# Altium schematic sheet Control.SchDoc
size A4; SheetNumber: 2; SheetTotal: 4
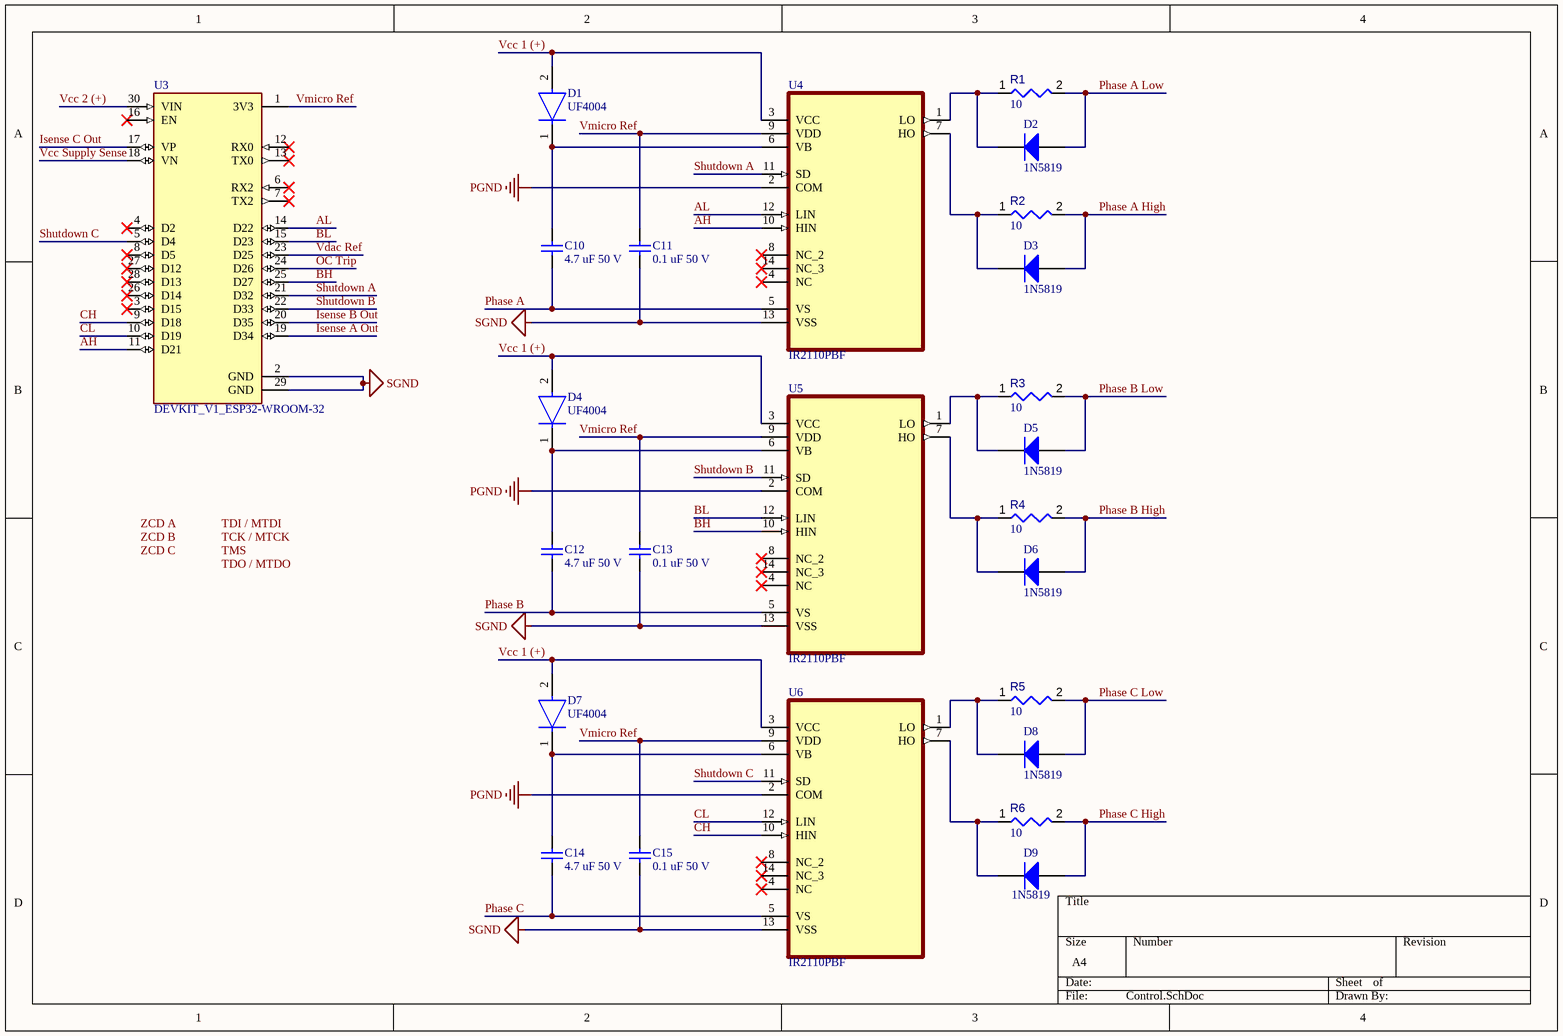
[diagram p0: Control.SchDoc]

## Parts
C10  4.7 uF 50 V  [CAPR51-254-508X318X736]
C11  0.1 uF 50 V  [CAPR51-254-508X318X736]
C12  4.7 uF 50 V  [CAPR51-254-508X318X736]
C13  0.1 uF 50 V  [CAPR51-254-508X318X736]
C14  4.7 uF 50 V  [CAPR51-254-508X318X736]
C15  0.1 uF 50 V  [CAPR51-254-508X318X736]
D1  UF4004  [FP-017AH-MFG]
D2  1N5819  [ONSC-AXIAL_LEAD-2-59-10_P]
D3  1N5819  [ONSC-AXIAL_LEAD-2-59-10_P]
D4  UF4004  [FP-017AH-MFG]
D5  1N5819  [ONSC-AXIAL_LEAD-2-59-10_P]
D6  1N5819  [ONSC-AXIAL_LEAD-2-59-10_P]
D7  UF4004  [FP-017AH-MFG]
D8  1N5819  [ONSC-AXIAL_LEAD-2-59-10_P]
D9  1N5819  [ONSC-AXIAL_LEAD-2-59-10_P]
R1  value 10  [RESA60-630X240]  (hidden comment: MFR-25FBF52-10R)
R2  value 10  [RESA60-630X240]  (hidden comment: MFR-25FBF52-10R)
R3  value 10  [RESA60-630X240]  (hidden comment: MFR-25FBF52-10R)
R4  value 10  [RESA60-630X240]  (hidden comment: MFR-25FBF52-10R)
R5  value 10  [RESA60-630X240]  (hidden comment: MFR-25FBF52-10R)
R6  value 10  [RESA60-630X240]  (hidden comment: MFR-25FBF52-10R)
U3  DEVKIT_V1_ESP32-WROOM-32  [MODULE_DEVKIT_V1_ESP32-WROOM-32]
U4  IR2110PBF  [DIP254P762X533-14]
U5  IR2110PBF  [DIP254P762X533-14]
U6  IR2110PBF  [DIP254P762X533-14]

## Nets
PGND: U4.2(COM) U5.2(COM) U6.2(COM)
SGND: C11.1 C13.1 C15.1 U3.2(GND) U3.29(GND) U4.13(VSS) U5.13(VSS) U6.13(VSS)
AH: U3.11(D21) U4.10(HIN)
AL: U3.14(D22) U4.12(LIN)
BH: U3.25(D27) U5.10(HIN)
BL: U3.15(D23) U5.12(LIN)
CH: U3.9(D18) U6.10(HIN)
CL: U3.10(D19) U6.12(LIN)
Isense A Out: U3.19(D34)
Isense B Out: U3.20(D35)
Isense C Out: U3.17(VP)
OC Trip: U3.24(D26)
Phase A: C10.1 U4.5(VS)
Phase A High: D3.1(A) R2.2
Phase A Low: D2.1(A) R1.2
Phase B: C12.1 U5.5(VS)
Phase B High: D6.1(A) R4.2
Phase B Low: D5.1(A) R3.2
Phase C: C14.1 U6.5(VS)
Phase C High: D9.1(A) R6.2
Phase C Low: D8.1(A) R5.2
Shutdown A: U3.21(D32) U4.11(SD)
Shutdown B: U3.22(D33) U5.11(SD)
Shutdown C: U3.5(D4) U6.11(SD)
Vcc 1 (+): D1.2(A) D4.2(A) D7.2(A) U4.3(VCC) U5.3(VCC) U6.3(VCC)
Vcc 2 (+): U3.30(VIN)
Vcc Supply Sense: U3.18(VN)
Vdac Ref: U3.23(D25)
Vmicro Ref: C11.2 C13.2 C15.2 U3.1(3V3) U4.9(VDD) U5.9(VDD) U6.9(VDD)
NetC10_2: C10.2 D1.1(C) U4.6(VB)
NetC12_2: C12.2 D4.1(C) U5.6(VB)
NetC14_2: C14.2 D7.1(C) U6.6(VB)
NetD2_2: D2.2(K) R1.1 U4.1(LO)
NetD3_2: D3.2(K) R2.1 U4.7(HO)
NetD5_2: D5.2(K) R3.1 U5.1(LO)
NetD6_2: D6.2(K) R4.1 U5.7(HO)
NetD8_2: D8.2(K) R5.1 U6.1(LO)
NetD9_2: D9.2(K) R6.1 U6.7(HO)

Not connected (* = marked no-connect by the designer): U3 3(D15)* 4(D2)* 6(RX2)* 7(TX2)* 8(D5)* 12(RX0)* 13(TX0)* 16(EN)* 26(D14)* 27(D12)* 28(D13)*; U4 4(NC)* 8(NC_2)* 14(NC_3)*; U5 4(NC)* 8(NC_2)* 14(NC_3)*; U6 4(NC)* 8(NC_2)* 14(NC_3)*

## Notes on the sheet
- Labels drawn without touching a wire or pin: TCK / MTCK, TDI / MTDI, TDO / MTDO, TMS, ZCD A, ZCD B, ZCD C

## Library data of the parts
C10-C15 = CMP-1664-00004-1: Radial Leaded Multilayer Ceramic Capacitor, 0.1 uF, +/- 10%, 50 V, -55 to 125 degC, 2-Pin THD, RoHS, Tape and Reel; Case\Package: SOT-23-5; Max Power Dissipation: 250 mW; Output Current: 150 mA; Dropout Voltage: 260 mV; Outputs: 1; Output Voltage: 5 V; Max Input Voltage: 8 V; Min Operating Temperature: -40 degC; Packaging: Tape and Reel; Height: 1.3 mm; Radiation Hardening: No; Pins: 5; ComponentLink1Description: Manufacturer URL; Mount: Surface Mount; RoHSCompliant: true; Max Operating Temperature: 85 degC; PackageReference: CAPR51-254-508X318X736; ComponentLink2URL: http://www.kemet.com/docfinder?Partnumber=C320C104K5R5TA; PackageDescription: 2-Pin Through Hole Device, Body 5.08 x 3.18 mm, Pitch 2.54 mm; ComponentLink1URL: http://www.kemet.com/; Width: 1.8 mm; Package Quantity: 3000; DatasheetVersion: Dec-15; Length: 3 mm; ComponentLink2Description: Datasheet
D1 D4 D7 = CMP-00278-84331690-1: UF4004 Rectifier Diode, 1 Phase, 1 Element, 1A, 400V V(RRM), Silicon, DO-41; Manufacturer Lifecycle Status: ACTIVE, NOT REC; Max Surge Current: 30A; Power Dissipation: 2.08W; Max Junction Temperature (Tj): 150°C; Element Configuration: Single; Capacitance: 17pF; Recovery Time: 50ns; Forward Voltage: 1V; Polarity: Standard; Peak Reverse Current: 10µA; Max Repetitive Reverse Voltage (Vrrm): 400V; Max Operating Temperature: 150°C; Lead Free: Lead Free; Output Current: 1A; Min Operating Temperature: -65°C; Reverse Voltage: 400V; Lifecycle Status: NRND; Peak Non-Repetitive Surge Current: 30A; Height: 2.72mm; Packaging: Cut Tape; REACH SVHC: No SVHC; Number of Pins: 2; Max Reverse Voltage (DC): 400V; NexarPartId: 84331690; Radiation Hardening: No; Current Rating: 1A; Length: 5.2mm; Average Rectified Current: 1A; Forward Current: 1A; Width: 6.35mm; Reverse Recovery Time: 50ns; Mount: Through Hole; Weight: 245mg; RoHS: Compliant; Voltage Rating (DC): 400V; Schedule B: 8541100080, 8541100080; Diameter: 2.72mm; Max Forward Surge Current (Ifsm): 30A; Contact Plating: Tin
D2 D3 D5 D6 D8 D9 = CMP-004-00009-2: Low Drop Power Schottky Rectifier, 40 V, 1 A, 2-Pin DO-41, RoHS; Manufacturer: ON Semiconductor; Max Surge Current: 25A; Forward Current: 1A; Package Version: Rev. U, 02/2005; Peak Reverse Current: 1mA; Max Operating Temperature: 125°C; Case/Package: DO; Package URL: http://www.onsemi.cn/pub_link/Collateral/59-10.PDF; Packaging: Bulk; Manufacturer URL: http://www.onsemi.com/; Min Operating Temperature: -65°C; Package Description: 2-Pin, Axial Lead, Diameter 2.35 mm; Mounting Technology: TH; Datasheet URL: http://www.onsemi.cn/pub_link/Collateral/1N5817-D.PDF; Datasheet Version: Rev. 10, 07/2006; Package Reference: AXIAL_LEAD-2-59-10; Pins: 2; RoHS Compliant: True
R1-R6 = CMP-009-00048-4: 10 Ohms ±1% 0.25W, 1/4W Through Hole Resistor Axial Metal Film; Manufacturer: Yageo; Voltage Rating: 250V; Power: 250mW; Min Operating Temperature: -55°C; Max Operating Temperature: 155°C; Tolerance: 1%; Package Reference: MFR-25; Composition: CarbonFilm; Mounting Technology: TH; Packaging: Bulk; Case/Package: Axial; Datasheet URL: http://www.yageo.com/documents/recent/Yageo%20LR_MFR_2013.pdf; Package Quantity: 200; Manufacturer URL: http://www.yageo.com/; Package Description: 2-Pin Axial Lead, Dia 2.4 mm, Body Length 6.3 mm; Datasheet Version: Apr-13; RoHS Compliant: True
U3 = DEVKIT_V1_ESP32-WROOM-32: WROOM-32 Development Board ESP32 ESP-32S WiFi Bluetooth Dev Module; MF: Do it; MP: DEVKIT V1 ESP32-WROOM-32; SnapEDA_Link: https://www.snapeda.com/parts/DEVKIT%20V1%20ESP32-WROOM-32/Do+it/view-part/?ref=snap; Package: Package; Value: *; Check_prices: https://www.snapeda.com/parts/DEVKIT%20V1%20ESP32-WROOM-32/Do+it/view-part/?ref=eda
U4-U6 = IR2110PBF: High and Low Side Driver, All High Voltage Pins On One Side, Separate Logic and Power Ground, Shut-Down; MF: Infineon; Availability: In Stock; Value: *; Price: None; Check_prices: https://www.snapeda.com/parts/IR2110PBF/Infineon+Technologies/view-part/?ref=eda; Purchase-URL: https://pricing.snapeda.com/search/part/IR2110PBF/?ref=eda; SnapEDA_Link: https://www.snapeda.com/parts/IR2110PBF/Infineon+Technologies/view-part/?ref=snap; MP: IR2110PBF; Package: DIP-14 Infineon